# EAGLE schematic eagle (EAGLE 9.0.0)
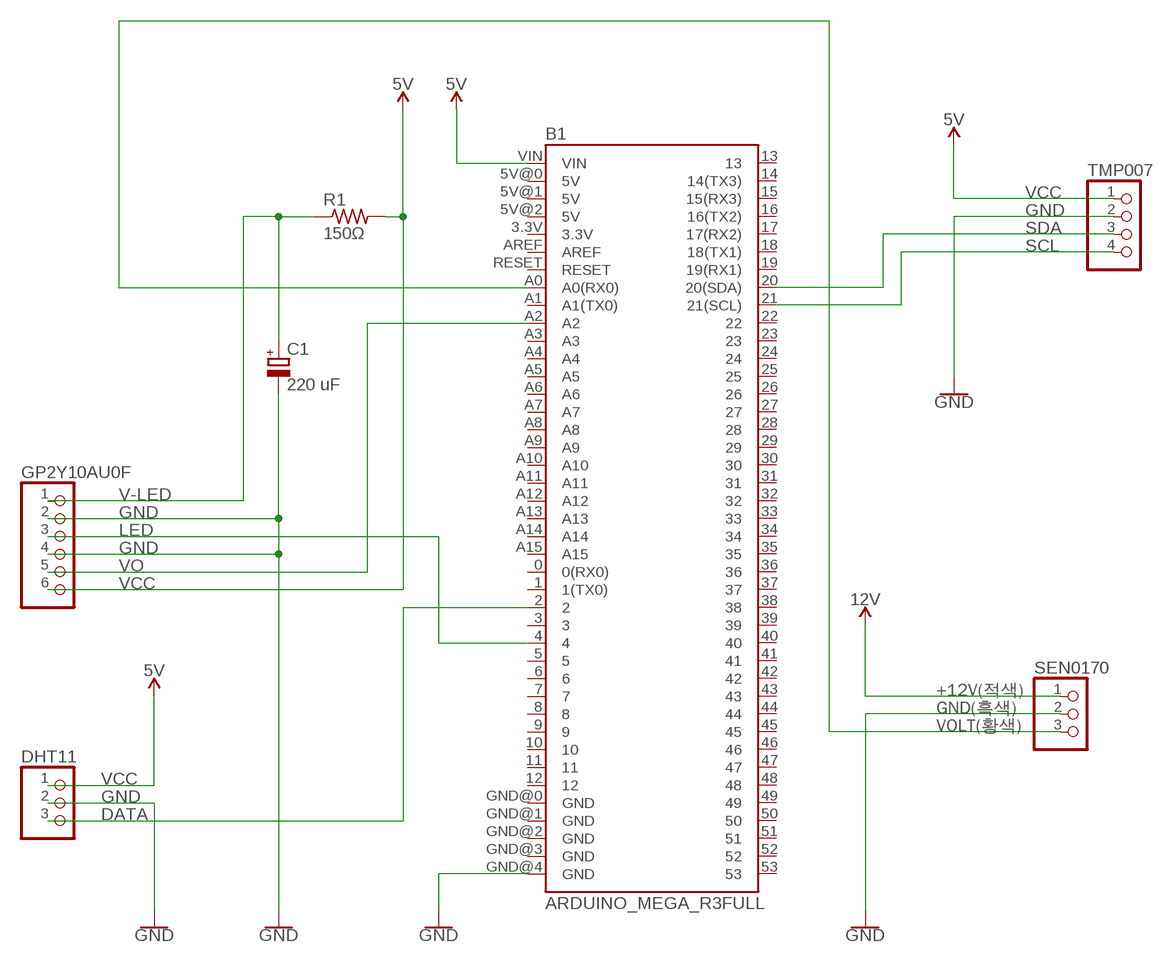
[diagram p0: schematic, sheet 1]

## Parts
B1  ARDUINO_MEGA_R3FULL  [ARDUINO_MEGA]
C1  220 uF  CPOL-EUE2.5-5  [E2,5-5]
DHT11  PINHD-1X3  [1X03]
GP2Y10AU0F  PINHD-1X6  [1X06]
R1  150Ω  R-US_R1206  [R1206]
SEN0170  PINHD-1X3  [1X03]
TMP007  PINHD-1X4  [1X04]

## Nets
+12V(적색): SEN0170.1 ; supply symbol labelled 12V
DATA: B1.2 DHT11.3
GND: B1.GND@4(GND) C1.- DHT11.2 GP2Y10AU0F.2 GP2Y10AU0F.4 TMP007.2
GND(흑색): SEN0170.2 ; supply symbol labelled GND
LED: B1.4 GP2Y10AU0F.3
SCL: B1.21(21(SCL)) TMP007.4
SDA: B1.20(20(SDA)) TMP007.3
V-LED: C1.+ GP2Y10AU0F.1 R1.1
VCC: B1.VIN DHT11.1 GP2Y10AU0F.6 R1.2 TMP007.1 ; supply symbol labelled 5V
VO: B1.A2 GP2Y10AU0F.5
VOLT(황색): B1.A0(A0(RX0)) SEN0170.3
Unconnected: B1.0(0(RX0)) B1.1(1(TX0)) B1.3 B1.3.3V B1.5 B1.5V@0(5V) B1.5V@1(5V) B1.5V@2(5V) B1.6 B1.7 B1.8 B1.9 B1.10 B1.11 B1.12 B1.13 B1.14(14(TX3)) B1.15(15(RX3)) B1.16(16(TX2)) B1.17(17(RX2)) B1.18(18(TX1)) B1.19(19(RX1)) B1.22 B1.23 B1.24 B1.25 B1.26 B1.27 B1.28 B1.29 B1.30 B1.31 B1.32 B1.33 B1.34 B1.35 B1.36 B1.37 B1.38 B1.39 B1.40 B1.41 B1.42 B1.43 B1.44 B1.45 B1.46 B1.47 B1.48 B1.49 B1.50 B1.51 B1.52 B1.53 B1.A1(A1(TX0)) B1.A3 B1.A4 B1.A5 B1.A6 B1.A7 B1.A8 B1.A9 B1.A10 B1.A11 B1.A12 B1.A13 B1.A14 B1.A15 B1.AREF B1.GND@0(GND) B1.GND@1(GND) B1.GND@2(GND) B1.GND@3(GND) B1.RESET

## Library data of the parts
B1 = SparkFun-Boards:ARDUINO_MEGA_R3: Arduino Mega R3 ATmega2560 R3 compatible footprint. SparkFun Products: Arduino Mega 2560 R3 <https://www.sparkfun.com/products/11061>
C1 = rcl:CPOL-EU: POLARIZED CAPACITOR, European symbol; SPICEPREFIX: C
DHT11 SEN0170 = pinhead:PINHD-1X3: PIN HEADER
GP2Y10AU0F = pinhead:PINHD-1X6: PIN HEADER
R1 = audio amplifier example:R-US_: RESISTOR, American symbol
TMP007 = pinhead:PINHD-1X4: PIN HEADER